# EAGLE design grideye_breakout_v0 (EAGLE 6.5.0)
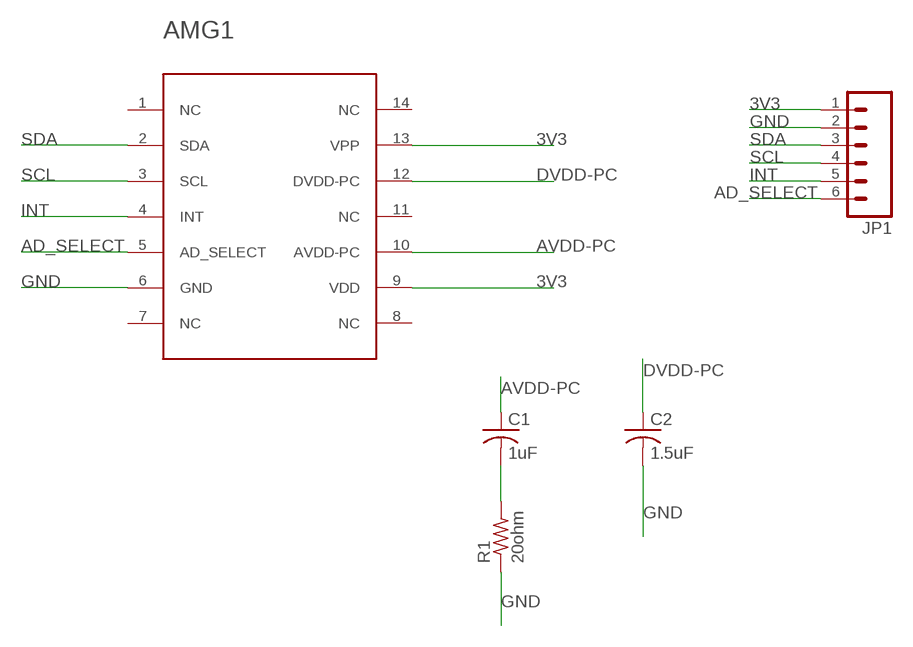
[diagram p0: schematic, sheet 1]

## Parts
AMG1  AMG8831  [AMG8831]
C1  1uF  C-USC0805  [C0805]
C2  1.5uF  C-USC0805  [C0805]
JP1  M06LOCK_LONGPADS  [1X06_LOCK_LONGPADS]
R1  20ohm  R-US_M0805  [M0805]

## Nets
3V3: AMG1.9(VDD) AMG1.13(VPP) JP1.1
AD_SELECT: AMG1.5(AD_SELECT) JP1.6
AVDD-PC: AMG1.10(AVDD-PC) C1.1
DVDD-PC: AMG1.12(DVDD-PC) C2.1
GND: AMG1.6(GND) C2.2 JP1.2 R1.1
INT: AMG1.4(INT) JP1.5
N$1: C1.2 R1.2
SCL: AMG1.3(SCL) JP1.4
SDA: AMG1.2(SDA) JP1.3
Unconnected: AMG1.1(NC) AMG1.7(NC) AMG1.8(NC) AMG1.11(NC) AMG1.14(NC)

## Library data of the parts
AMG1 = AKA_test:AMG8831: Infrared Array Sensor Grid-EYE (AMG88) High Precision Infrared Array Sensor based on Advanced MEMS Technology I2C interface This outline is good for all models AMG88-x-y x = 3 or 5, indicating supply voltage y = 1 or 2; 1 is high-gain, 2 is low-gain See the datasheet from Panasonic here <http://pewa.panasonic.com/assets/pcsd/catalog/grid-eye-catalog.pdf>
C1 C2 = adafruit:C-US: CAPACITOR, American symbol
JP1 = SparkFun-Connectors:M06: Header 6 Standard 6-pin 0.1" header. Use with straight break away headers (SKU : PRT-00116), right angle break away headers (PRT-00553), swiss pins (PRT-00743), machine pins (PRT-00117), and female headers (PRT-00115). Molex polarized connector foot print use with SKU : PRT-08094 with associated crimp pins and housings. NOTES ON THE VARIANTS LOCK and LOCK_LONGPADS... This footprint was designed to help hold the alignment of a through-hole component (i.e. 6-pin header) while soldering it into place. You may notice that each hole has been shifted either up or down by 0.005 of an inch from it's more standard position (which is a perfectly straight line). This slight alteration caused the pins (the squares in the middle) to touch the edges of the holes. Because they are alternating, it causes a "brace" to hold the component in place. 0.005 has proven to be the perfect amount of "off-center" position when using our standard breakaway headers. Although looks a little odd when you look at the bare footprint, once you have a header in there, the alteration is very hard to notice. Also,if you push a header all the way into place, it is covered up entirely on the bottom side. This idea of altering the position of holes to aid alignment will be further integrated into the Sparkfun Library for other footprints. It can help hold any component with 3 or more connection pins.
R1 = adafruit:R-US_: RESISTOR, American symbol

## Board
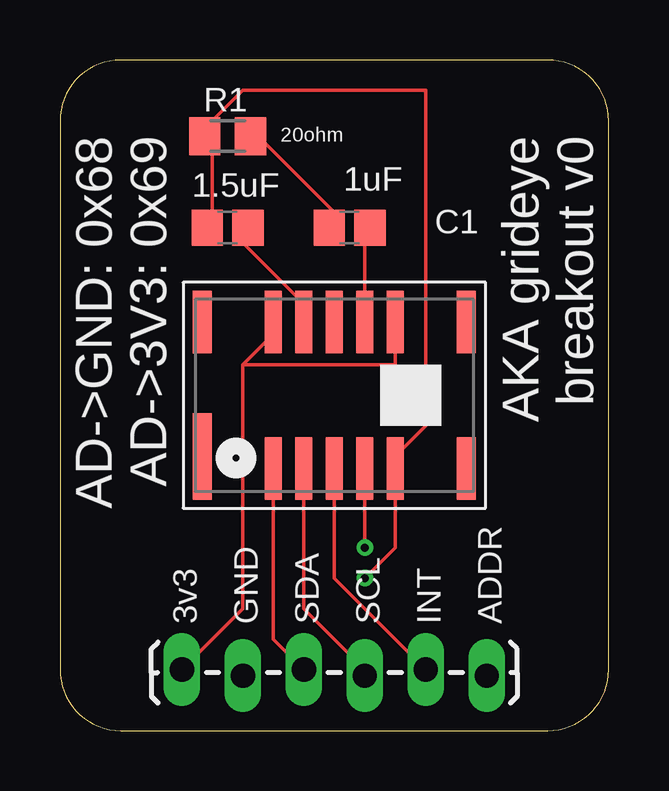
[diagram p1: board, top side]
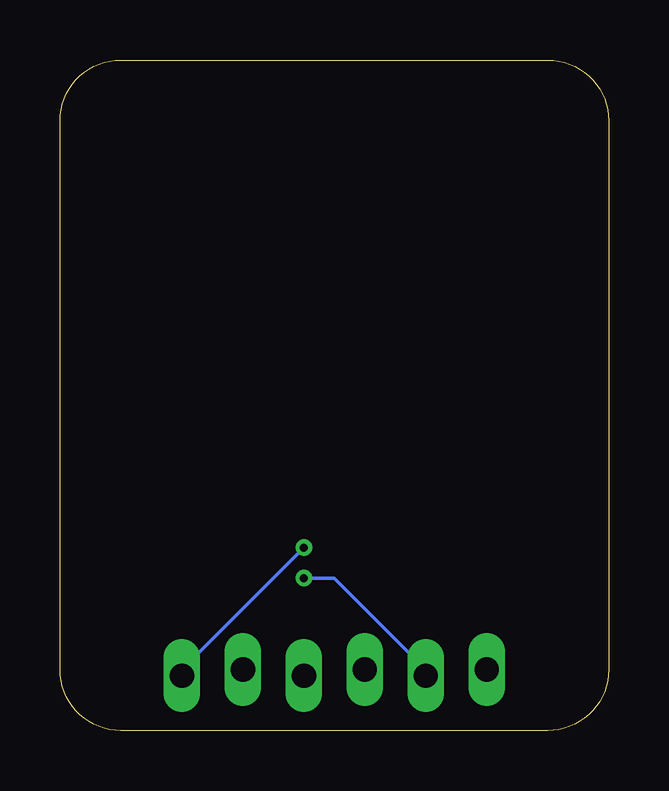
[diagram p2: board, bottom side, seen from below]

Size 22.86 x 27.94 mm. Coordinates in mm from the lower left corner, seen from the top.
Outline: 2.54,0 20.32,0 arc90 22.86,2.54 22.86,25.4 arc90 20.32,27.94 2.54,27.94 arc90 0,25.4 0,2.54 arc90 2.54,0
Copper layers (1*16): Top 0.0356mm / dielectric 1.5011mm / Bottom 0.0356mm
Design rules "LaenPCBOrder": minimum track width 6mil, minimum drill 13mil, track to track 6mil, track to pad 6mil, pad to pad 6mil, via to via 6mil, smd to smd 6mil, copper to edge 15mil, drill to drill 6mil, minimum pad ring 7mil, minimum via ring 7mil, stop-mask expansion 3mil, vias tented up to drill 0mil, thermal gap 10mil

### Footprints (pad centres in the part's own frame; a part is rotated, then mirrored left to right if it is on the bottom)
AMG8831 = smd 0.8 x 3.6: 1 -5.5,-2.55 | smd 0.7 x 2.6: 2 -2.54,-3.05; 3 -1.27,-3.05; 4 0,-3.05; 5 1.27,-3.05; 6 2.54,-3.05; 9 2.54,3.05; 10 1.27,3.05; 11 0,3.05; 12 -1.27,3.05; 13 -2.54,3.05 | smd 0.8 x 2.6: 7 5.5,-3.05; 8 5.5,3.05; 14 -5.5,3.05
C0805 = smd 1.3 x 1.5: 1 -0.85,0; 2 0.85,0
1X06_LOCK_LONGPADS = drill 1.016 long: 1 0,0; 2 2.54,-0.254; 3 5.08,0; 4 7.62,-0.254; 5 10.16,0; 6 12.7,-0.254
M0805 = smd 1.3 x 1.6: 1 -0.95,0; 2 0.95,0

### Placement (x,y rotation side)
AMG1  11.43,13.97 0 top
C1  12.06,20.95 180 top
C2  6.99,20.95 180 top
JP1  5.08,2.54 0 top
R1  6.99,24.77 0 top

### Tracks (layer width: path | path; a pad name or v marks a point on that pad's centre or on a via)
3V3
  Top 0.152: 7.62,15.24 8.89,16.51 AMG1.13 | 7.62,15.24 7.62,5.08 JP1.1 | AMG1.9 13.97,15.24 7.62,15.24
AD_SELECT  (via drill 0.33)
  Top 0.152: v12.7,7.62 AMG1.5
  Bottom 0.152: v12.7,7.62 17.78,2.54 JP1.6
AVDD-PC
  Top 0.152: AMG1.10 12.7,20.32 C1.1
DVDD-PC
  Top 0.152: C2.1 7.62,20.32 10.16,17.78 AMG1.12
GND  (via drill 0.33)
  Top 0.152: v12.7,6.35 13.97,7.62 AMG1.6 13.97,11.43 15.24,12.7 15.24,26.67 7.62,26.67 6.35,25.4 R1.1 6.35,24.13 6.35,21.59 C2.2
  Bottom 0.152: v12.7,6.35 11.43,6.35 7.62,2.54 JP1.2
INT
  Top 0.152: AMG1.4 11.43,6.35 JP1.5
N$1
  Top 0.152: C1.2 11.43,21.59 7.62,25.4 R1.2
SCL
  Top 0.152: AMG1.3 10.16,5.08 12.7,2.54 JP1.4
SDA
  Top 0.152: AMG1.2 8.89,3.81 JP1.3

### Text on the board
tNames: AD->GND: 0x68 / AD->3V3: 0x69 | AKA grideye / breakout v0 | 3v3 | GND | SDA | SCL | INT | ADDR